# Altium project Fan Control.PrjPcb
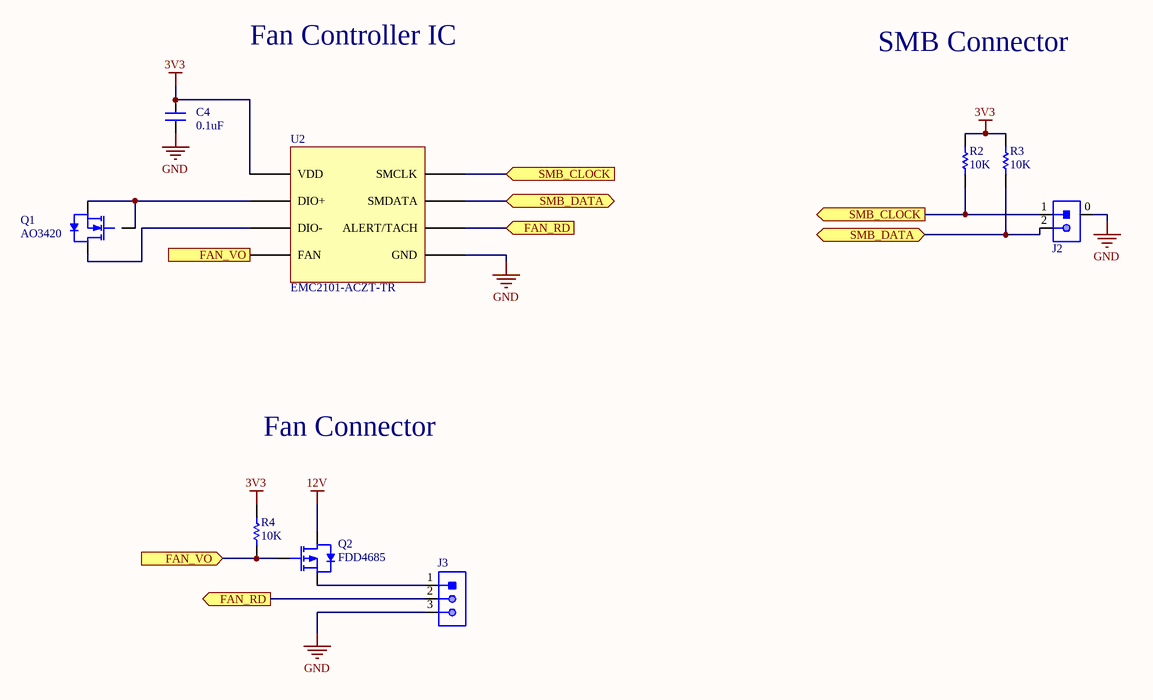
[diagram p0: Fan Controller.SchDoc]
2 sheets, 16 parts. Net scope: flat (ports and power ports of the same name join across sheets).
Sheets:
  Fan Controller.SchDoc
  Power.SchDoc

## Sheet Fan Controller.SchDoc: : Controller and Connector
size Letter; DrawnBy: Tony Liu; Organization: UW Robotics; Address1: 200 University Avenue; Address2: Waterloo; Address3: Ontario; Address4: Canada N2L 3G6; SheetNumber: 1; SheetTotal: 1; Time: 2020-05-07

### Parts
C4  value 0.1uF  [CAPC2012X140N]  (hidden comment: CAP_0.1uF_50V_0805)
J2  CON_2M_SM4  [JST-B2B-SM4-TB]  (value not drawn)
J3  CON_3M_TERM  [3 PIN TERM]  (value not drawn)
Q1  Manufacturer Part Number 1: AO3420  [NMOS_SOT23-3]  (hidden comment: NMOS_20V_6A)
Q2  Manufacturer Part Number 1: FDD4685  [D-PAK]  (hidden comment: PMOS_40V_8.4A)
R2  value 10K  [RESC0603(1608)_N]  (hidden comment: RES_10K_0603)
R3  value 10K  [RESC0603(1608)_N]  (hidden comment: RES_10K_0603)
R4  value 10K  [RESC0603(1608)_N]  (hidden comment: RES_10K_0603)
U2  EMC2101-ACZT-TR  [SOIC-8_SG]

### Ports
FAN_RD (in), FAN_RD (out), FAN_VO (in), FAN_VO (out), SMB_CLOCK (in), SMB_CLOCK (out), SMB_DATA (bidir)

### Nets
3V3: C4.2 R2.2 R3.2 R4.1 U2.1(VDD)
12V: Q2.1(Drain)
GND: C4.1 J2.0 J3.3 U2.5(GND)
NetJ2_1: J2.1 R2.1 U2.8(SMCLK) ; port SMB_CLOCK
NetJ2_2: J2.2 R3.1 U2.7(SMDATA) ; port SMB_DATA
NetJ3_1: J3.1 Q2.3(Source)
NetJ3_2: J3.2 U2.6(ALERT/TACH) ; port FAN_RD
NetQ1_1: Q1.1(G) Q1.2(S) U2.2(DIO+)
NetQ1_3: Q1.3(D) U2.3(DIO-)
NetQ2_2: Q2.2(Gate) R4.2 U2.4(FAN) ; port FAN_VO

### Notes on the sheet
- Fan Controller IC
- SMB Connector
- Fan Connector
- Title
- Size:
- Date:
- Letter
- Drawn By:
- Sheet
- of
- File:

### Library data of the parts
C4 = CAP_0.1uF_50V_0805: CAP CER 0.1UF 50V X7R 0805; Manufacturer 1: Murata Electronics; Manufacturer Part Number 1: GCD21BR71H104KA01L; Capacitance: 100nF; Tolerance: 10%; Mount: Surface Mount; Case/Package: 0805; Case Code (Metric): 2012; Case Code (Imperial): 0805; Min Operating Temperature: -55°C; Max Operating Temperature: 125°C; Dielectric: X7R; Termination: SMD/SMT; Length: 2mm; Height: 1.25mm; Width: 0.049inch; Thickness: 0.049inch; Depth: 1.25mm; Ratings: AEC-Q200; ComponentLink1URL: https://datasheet.ciiva.com/29537/c03e-29537701.pdf?src-supplier=Digi-Key; ComponentLink1Description: https://datasheet.ciiva.com/29537/c03e-29537701.pdf?src-supplier=Digi-Key; Supplier 1: Digi-Key; Supplier Part Number 1: 490-11955-1-ND; Voltage Rating: 50V
J2 = CON_2M_SM4: CONN HEADER SMD 2POS 2MM; Manufacturer 1: JST; Manufacturer Part Number 1: B2B-PH-SM4-TB(LF)(SN); Max Current Rating: 2A; Max Voltage Rating: 100V; Supplier 1: Digi-Key; Supplier Part Number 1: 455-1734-1-ND; ComponentLink1URL: https://datasheet.ciiva.com/11748/0900766b80ddea81-11748001.pdf?src-supplier=RSComponents; ComponentLink1Description: https://datasheet.ciiva.com/11748/0900766b80ddea81-11748001.pdf?src-supplier=RSComponents; ComponentLink2URL: https://datasheet.ciiva.com/16216/b2b-ph-sm4-tblfsn-16216102.pdf?src-supplier=Future+Electronics; ComponentLink2Description: https://datasheet.ciiva.com/16216/b2b-ph-sm4-tblfsn-16216102.pdf?src-supplier=Future+Electronics; ComponentLink3URL: https://datasheet.ciiva.com/8052/80567-8052023.pdf?src-supplier=Element14; ComponentLink3Description: https://datasheet.ciiva.com/8052/80567-8052023.pdf?src-supplier=Element14; ComponentLink4URL: https://datasheet.ciiva.com/712/eph-712504.pdf?src-supplier=Digi-Key; ComponentLink4Description: https://datasheet.ciiva.com/712/eph-712504.pdf?src-supplier=Digi-Key; ComponentLink5URL: https://datasheet.ciiva.com/712/eph-712505.pdf?src-supplier=Digi-Key; ComponentLink5Description: https://datasheet.ciiva.com/712/eph-712505.pdf?src-supplier=Digi-Key; ComponentLink6URL: https://datasheet.ciiva.com/712/eph-712506.pdf?src-supplier=Digi-Key; ComponentLink6Description: https://datasheet.ciiva.com/712/eph-712506.pdf?src-supplier=Digi-Key; Pitch: 2mm; Mount: Surface Mount
J3 = CON_3M_TERM: TERM BLK 3POS SIDE ENTRY 5MM PCB; Manufacturer 1: Phoenix Contact; Manufacturer Part Number 1: 1734669; Supplier 1: Digi-Key; Supplier Part Number 1: 277-1980-ND; Mount: Thru Hole
Q1 = NMOS_20V_6A: MOSFET N-CH 20V 6A SOT23; Manufacturer 1: Alpha & Omega; Package: TO-236-3, SC-59, SOT-23-3; ComponentLink1Description: Datasheet; ComponentLink1URL: http://aosmd.com/res/data_sheets/AO3420.pdf; Supplier Part Number 1: 785-1014-1-ND; Supplier 1: Digi-Key; Mount: Surface Mount
Q2 = PMOS_40V_8.4A: MOSFET P-CH 40V 8.4A D-PAK; Manufacturer 1: ON Semiconductor / Fairchild; Max Power Dissipation: 69W; Fall Time: 14ns; Drain to Source Resistance: 27mR; Turn-Off Delay Time: 34ns; Threshold Voltage: -1.6V; Number of Elements: 1; Turn-On Delay Time: 8ns; Gate to Source Voltage (Vgs): 20V; Input Capacitance: 2.38nF; Rise Time: 15ns; Element Configuration: Single; Drain to Source Breakdown Voltage: -40V; Current Rating: -8.4A; Supplier 1: Digi-Key; Stock 1: 9732; Pricing 1: 1=1.03000, 10=0.92200, 25=0.87560, 100=0.65670, 250=0.65040, 500=0.55660, 1000=0.45342 (USD); RoHS: Yes; Mount: Surface Mount; Case/Package: TO-252; Number of Pins: 3; Weight: 0.26037g; Contact Plating: Tin,Matte; Min Operating Temperature: -55°C; Max Operating Temperature: 150°C; Drain to Source Voltage (Vdss): 40V; Continuous Drain Current (ID): 8.4A; Power Dissipation: 69W; Termination: SMD/SMT; On-State Resistance: 27MR; Package Quantity: 2500; Rds On Max: 27mR; Packaging: Tape and Reel; Nominal Vgs: -1.6V; Voltage Rating (DC): -40V; Dual Supply Voltage: -40V; Length: 6.73mm; Height: 2.39mm; Width: 6.22mm; Radiation Hardening: No; REACH SVHC: No SVHC; Lead Free: Lead Free; ComponentLink1URL: https://datasheet.ciiva.com/6382/fdd4685-6382336.pdf?src-supplier=Digi-Key; ComponentLink1Description: https://datasheet.ciiva.com/6382/fdd4685-6382336.pdf?src-supplier=Digi-Key; ComponentLink2URL: https://datasheet.ciiva.com/22700/298848-22700881.pdf?src-supplier=Element14; ComponentLink2Description: https://datasheet.ciiva.com/22700/298848-22700881.pdf?src-supplier=Element14; ComponentLink3URL: https://datasheet.ciiva.com/4439/fdd4685-94891-4439978.pdf?src-supplier=Mouser; ComponentLink3Description: https://datasheet.ciiva.com/4439/fdd4685-94891-4439978.pdf?src-supplier=Mouser; ComponentLink4URL: https://datasheet.ciiva.com/7967/298848-7967879.pdf?src-supplier=Element14; ComponentLink4Description: https://datasheet.ciiva.com/7967/298848-7967879.pdf?src-supplier=Element14; ComponentLink5URL: https://datasheet.ciiva.com/26144/fdd4685-26144727.pdf?src-supplier=Avnet+Europe; ComponentLink5Description: https://datasheet.ciiva.com/26144/fdd4685-26144727.pdf?src-supplier=Avnet+Europe; ComponentLink6URL: https://datasheet.ciiva.com/22746/1930081-22746458.pdf?src-supplier=Element14; ComponentLink6Description: https://datasheet.ciiva.com/22746/1930081-22746458.pdf?src-supplier=Element14; ComponentLink7URL: https://datasheet.ciiva.com/22655/1930081-22655292.pdf?src-supplier=Element14; ComponentLink7Description: https://datasheet.ciiva.com/22655/1930081-22655292.pdf?src-supplier=Element14; ComponentLink8URL: https://datasheet.ciiva.com/16742/fdd4685-16742918.pdf?src-supplier=Future+Electronics; ComponentLink8Description: https://datasheet.ciiva.com/16742/fdd4685-16742918.pdf?src-supplier=Future+Electronics; ComponentLink9URL: https://datasheet.ciiva.com/11175/fdd4685-11175308.pdf?src-supplier=Avnet; ComponentLink9Description: https://datasheet.ciiva.com/11175/fdd4685-11175308.pdf?src-supplier=Avnet; Supplier Part Number 1: FDD4685CT-ND
R2-R4 = RES_10K_0603: RES SMD 10K OHM 5% 1/10W 0603; Manufacturer 1: Yageo; Manufacturer Part Number 1: RC0603JR-0710KL; Package: 0603 (1608 Metric); Dimensions: 0.063" L x 0.031" W (1.60mm x 0.80mm); Tolerance: 5%; Supplier Part Number 1: 311-10KGRCT-ND; Supplier 1: Digi-Key; Mount: Surface Mount
U2 = EMC2101-ACZT-TR: SMBUS FAN CONTROL WITH TEMP MONITORING; Manufacturer 1: Microchip Technology; Supplier Part Number 1: EMC2101-ACZT-CT-ND; Mount: Surface Mount; Manufacturer Part Number 1: EMC2101-ACZT-TR; Supplier 1: Digi-Key

## Sheet Power.SchDoc: Power and Connector
size Letter; DrawnBy: Tony Liu; Organization: UW Robotics; Address1: 200 University Avenue; Address2: Waterloo; Address3: Ontario; Address4: Canada N2L 3G6; SheetNumber: 1; SheetTotal: 1; Time: 2020-05-07
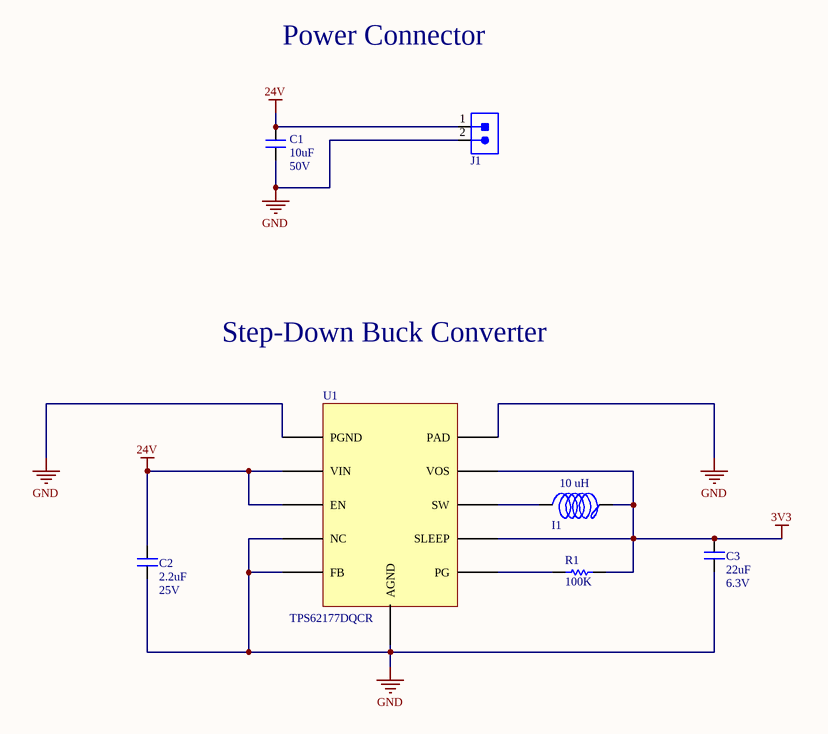
[diagram p1: Power.SchDoc]

### Parts
C1  Voltage Rating: 50V  [CAPC1206(3216)]  (hidden comment: 10uF)
C2  value 2.2uF  Voltage Rating: 25V  [CAPC2012X140N]  (hidden comment: CAP_2.2uF_25V_0805)
C3  value 22uF  Voltage Rating: 6.3V  [CAPC0603(1608)55_N]  (hidden comment: CAP_22uF_6.3V_0805)
I1  IND_10uH_6045  [IND_BOURNS_SRN6045]  (value not drawn)
J1  CON_2M_TERM  [1935161]  (value not drawn)
R1  value 100K  [RESC0603(1608)_N]  (hidden comment: RES_100K_0603)
U1  TPS62177DQCR  [DQC0010A]

### Nets
3V3: C3.2 I1.1 R1.1 U1.8(SLEEP) U1.10(VOS)
24V: C1.2 C2.2 J1.1 U1.2(VIN) U1.3(EN)
GND: C1.1 C2.1 C3.1 J1.2 U1.1(PGND) U1.4(NC) U1.5(FB) U1.6(AGND) U1.11(PAD)
NetI1_1: I1.1 U1.9(SW)
NetR1_2: R1.2 U1.7(PG)

### Notes on the sheet
- Power Connector
- Step-Down Buck Converter
- Title
- Size:
- Date:
- Letter
- Drawn By:
- Sheet
- of
- File:
- (in symbol IND_10uH_6045) 10 uH

### Library data of the parts
C1 = CAP_10uF_50V_1206: CAP CER 10UF 50V X5R 1206; Manufacturer Part Numer 1: GRT31CR61H106KE01L; Manufacturer 1: Murata; Dimensions: 0.126" L x 0.063" W (3.20mm x 1.6mm); Package: 1206 (3216 Metric); Supplier Part Number 1: 490-12456-1-ND; Supplier 1: Digi-Key; Mount: Surface Mount; Value: 10uF
C2 = CAP_2.2uF_25V_0805: CAP CER 2.2UF 25V X7R 0805; Manufacturer 1: Murata Electronics; Manufacturer Part Number 1: GRM21BR71E225KA73L; Capacitance: 2200nF; Tolerance: 10%; Mount: Surface Mount; Case/Package: 0805; Case Code (Metric): 2012; Case Code (Imperial): 0805; Min Operating Temperature: -55°C; Max Operating Temperature: 125°C; Dielectric: X7R; Termination: SMD/SMT; Length: 2mm; Height: 1.25mm; Width: 0.049inch; Thickness: 0.049inch; Depth: 1.25mm; Ratings: AEC-Q200; Supplier 1: Digi-Key; Supplier Part Number 1: 490-3331-2-ND
C3 = CAP_22uF_6.3V_0805: CAP CER 22UF 6.3V X5R 0805; Manufacturer 1: Murata Electronics; Manufacturer Part Number 1: GRM188R60J226MEA0D; Capacitance: 2200nF; Tolerance: 20%; Mount: Surface Mount; Case/Package: 0805; Case Code (Metric): 1608; Case Code (Imperial): 0603; Min Operating Temperature: -55°C; Max Operating Temperature: 85; Dielectric: X5R; Termination: SMD/SMT; Length: 1.6; Width: 0.031"; Thickness: 0.039inch; Depth: 1; Supplier 1: Digi-Key; Supplier Part Number 1: 490-7611-2-ND
I1 = IND_10uH_6045: IND WIRE 10 UH 6045; Manufacturer 1: Bourns Inc.; Manufacturer Part Number 1: SRN6045-100M; Supplier Part Number 1: SRN6045-100MTR-ND; Supplier 1: Digi-Key
J1 = CON_2M_TERM: TERM BLK 2POS SIDE ENTRY 5MM; Manufacturer 1: Phoenix Contact; Connector Type: Screw; Voltage Rating (DC): 320V; Max Current Rating: 16A; Max Supply Voltage: 250V; Current Rating: 17.5A; Number of Poles: 2; Number of Levels: 1; Current: 18A; Voltage: 300V; Wire Gauge (Max): 26AWG; Wire Gauge (Min): 12AWG; Approvals: UL; Supplier 1: Digi-Key; Manufacturer Part Number 1: 1935161; Stock 1: 15494; Pricing 1: 1=0.43000, 10=0.41100, 50=0.39280, 100=0.38200, 250=0.35700, 500=0.32844, 1000=0.30350 (USD); RoHS: Yes; Mount: Through Hole; Number of Pins: 2; Weight: 0.067021oz; Contact Material: Copper,Tin; Insulation Material: Nylon; Housing Material: Polyamide; Housing Color: Green; Color: Green; Material: Nylon; Number of Rows: 1; Voltage Rating: 250V; Package Quantity: 250; Packaging: Bulk; Number of Positions: 2; Number of Positions Per Level: 2; Termination: Solder; Number of Contacts: 2; Number of Circuits: 2; Orientation: Straight; Length: 9mm; Height: 11.3mm; Width: 14.9mm; Pitch: 5mm; Depth: 9mm; Wire/Cable Gauge: 26AWG; Radiation Hardening: No; Flammability Rating: UL94 V-0; Lead Free: Lead Free; REACH SVHC: Unknown; ComponentLink1URL: https://datasheet.ciiva.com/15169/getdatasheetpartid-177903-15169663.pdf?src-supplier=Verical; ComponentLink1Description: https://datasheet.ciiva.com/15169/getdatasheetpartid-177903-15169663.pdf?src-supplier=Verical; ComponentLink2URL: https://datasheet.ciiva.com/16047/1935161-16047247.pdf?src-supplier=Onlinecomponents.com; ComponentLink2Description: https://datasheet.ciiva.com/16047/1935161-16047247.pdf?src-supplier=Onlinecomponents.com; ComponentLink3URL: https://datasheet.ciiva.com/824/combiconcompact5-0mmseries-824222.pdf?src-supplier=Digi-Key; ComponentLink3Description: https://datasheet.ciiva.com/824/combiconcompact5-0mmseries-824222.pdf?src-supplier=Digi-Key; Supplier Part Number 1: 277-1667-ND
R1 = RES_100K_0603: RES SMD 100K OHM 5% 1/10W 0603; Manufacturer 1: Yageo; Manufacturer Part Number 1: RC0603FR-07261KL; Package: 0603 (1608 Metric); Dimensions: 0.063" L x 0.031" W (1.60mm x 0.80mm); Tolerance: 5%; Supplier Part Number 1: 311-261KHRCT-ND; Supplier 1: Digi-Key; Mount: Surface Mount
U1 = TPS62177DQCR: IC REG BUCK 3.3V 500MA 10WSON; Manufacturer 1: Texas Intruments; Supplier 1: Digi-Key; Supplier Part Number 1: 296-41856-1-ND; Manufacturer Part Number 1: TPS62177DQCR

## Nets that join several sheets
3V3: Fan Controller (5 pins), Power (5 pins)
GND: Fan Controller (C4.1 J2.0 J3.3 U2.5), Power (9 pins)